# Altium schematic sheet 100Hz陷波&电平移位&放大.SchDoc
size A4
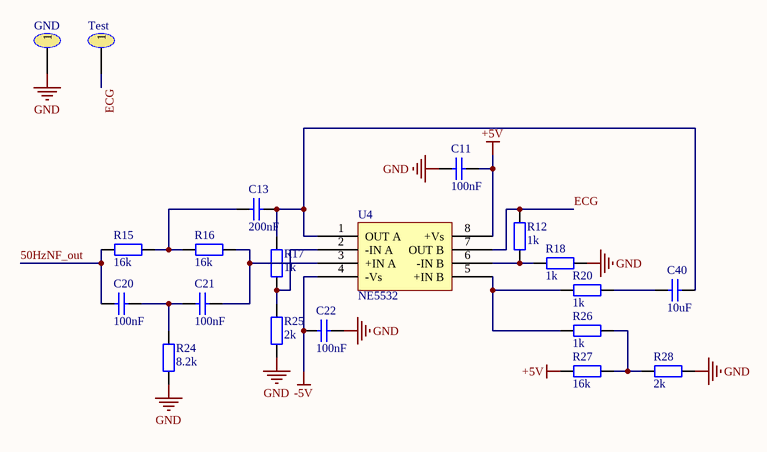
[diagram p0: 100Hz陷波&电平移位&放大.SchDoc]

## Parts
C11  100nF  [LC-0805_C]
C13  200nF  [LC-0805_C]
C20  100nF  [LC-0805_C]
C21  100nF  [LC-0805_C]
C22  100nF  [LC-0805_C]
C40  10uF  [LC-0805_C]
GND  ���Ժ���  [PAD]  (value not drawn)
R12  1k  [LC-0805_R]
R15  16k  [LC-0805_R]
R16  16k  [LC-0805_R]
R17  1k  [LC-0805_R]
R18  1k  [LC-0805_R]
R20  1k  [LC-0805_R]
R24  8.2k  [LC-0805_R]
R25  2k  [LC-0805_R]
R26  1k  [LC-0805_R]
R27  16k  [LC-0805_R]
R28  2k  [LC-0805_R]
Test  ���Ժ���  [PAD]  (value not drawn)
U4  NE5532  [DIP-8]

## Nets
+5V: C11.1 R27.2 U4.8(+Vs)
-5V: C22.2 U4.4(-Vs)
GND: C11.2 C22.1 GND.1 R18.1 R24.1 R25.1 R28.1
50HzNF_out: C20.2 R15.1
ECG: R12.2 Test.1 U4.7(OUT_B)
NetC13_1: C13.1 C40.2 R17.2 U4.1(OUT_A)
NetC13_2: C13.2 R15.2 R16.1
NetC20_1: C20.1 C21.2 R24.2
NetC21_1: C21.1 R16.2 U4.3(+IN_A)
NetC40_1: C40.1 R20.1
NetR12_1: R12.1 R18.2 U4.6(-IN_B)
NetR17_1: R17.1 R25.2 U4.2(-IN_A)
NetR20_2: R20.2 R26.2 U4.5(+IN_B)
NetR26_1: R26.1 R27.1 R28.2

## Library data of the parts
C11 C13 C20-C22 C40 = Cap: 100nF��0805��50V,+/-10%
GND Test = TestPoint: ��������
R12 R15-R18 R20 R24-R28 = R: 10k��,0805,��5%
U4 = NE5532: NE5532��SO-8